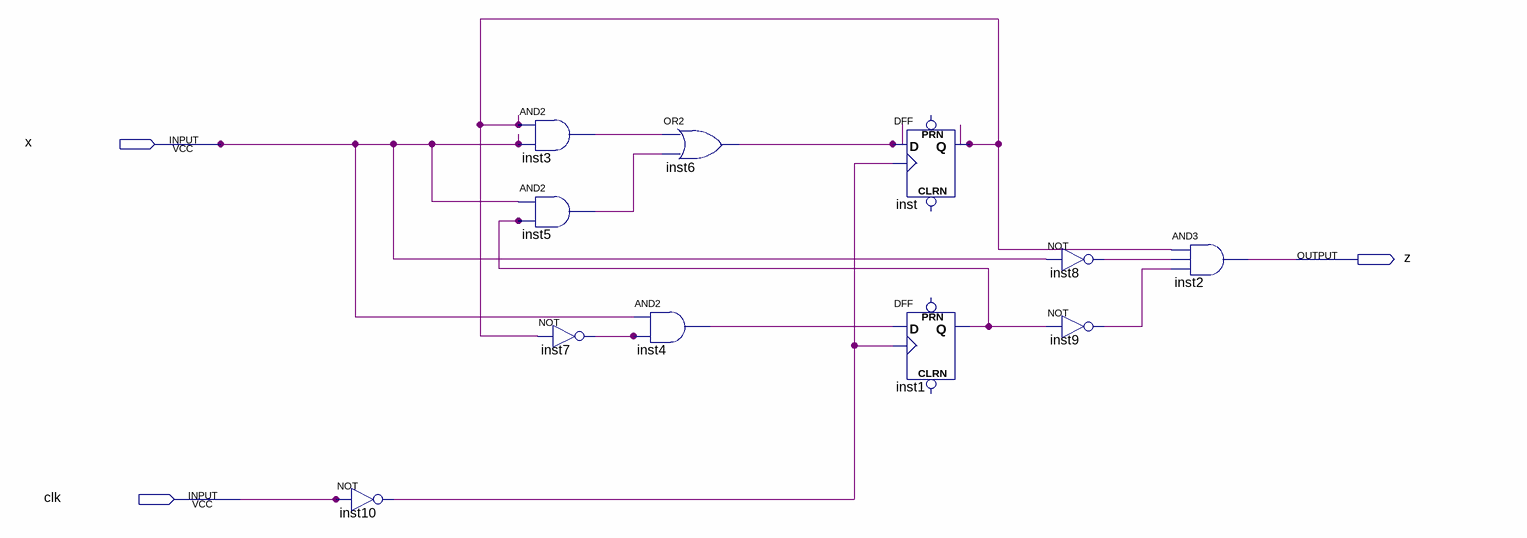
[diagram p0: schematic sheet]
// Quartus schematic state_mealy.bdf as structural Verilog: 11 symbols, 3 pins
module state_mealy (
  input  x,
  input  clk,
  output z
);

  wire inst1_q, inst3_out, inst4_out, inst5_out, inst6_out, inst7_out, inst8_out, inst9_out, inst10_out,
       inst_q;

  not inst10 (inst10_out, clk);
  and inst3 (inst3_out, inst_q, x);
  and inst5 (inst5_out, x, inst1_q);
  not inst7 (inst7_out, inst_q);
  and inst4 (inst4_out, x, inst7_out);
  or inst6 (inst6_out, inst3_out, inst5_out);
  DFF inst (.CLK(inst10_out), .D(inst6_out), .Q(inst_q));  // open: CLRN, PRN
  DFF inst1 (.CLK(inst10_out), .D(inst4_out), .Q(inst1_q));  // open: CLRN, PRN
  not inst8 (inst8_out, x);
  not inst9 (inst9_out, inst1_q);
  and inst2 (z, inst_q, inst8_out, inst9_out);
endmodule
